# Altium schematic sheet 1N4007-TP1_1N4007-TP.schdoc
size 127 x 101 mm
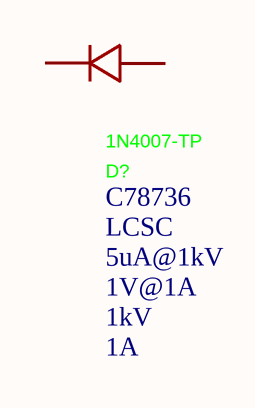
[diagram p0: 1N4007-TP1_1N4007-TP.schdoc]

## Parts
D?  1N4007-TP  Supplier Part: C78736  Supplier: LCSC  Voltage - Forward(Vf@If): 1V@1A  Voltage - DC Reverse(Vr): 1kV  Current - Rectified: 1A  Reverse Leakage Current (Ir): 5uA@1kV  [DO-41_BD2.4-L4.7-P8.70-D0.9-RD]

## Nets

Not connected (* = marked no-connect by the designer): D? 1(C) 2(A)

## Library data of the parts
D? = 1N4007-TP: Manufacturer: MCC(美微科); Add into BOM: yes; Non-Repetitive Peak Forward Surge Current: 30A; Operating Junction Temperature Range: -55℃~+150℃; Symbol: 1N4007-TP; Device: 1N4007-TP; Supplier Footprint: DO-41; LCSC Part Name: 1N4007-TP; Manufacturer Part: 1N4007-TP; JLCPCB Part Class: Extended Part; Datasheet: https://item.szlcsc.com/datasheet/1N4007-TP/79873.html; Convert to PCB: yes; Diode Configuration: -